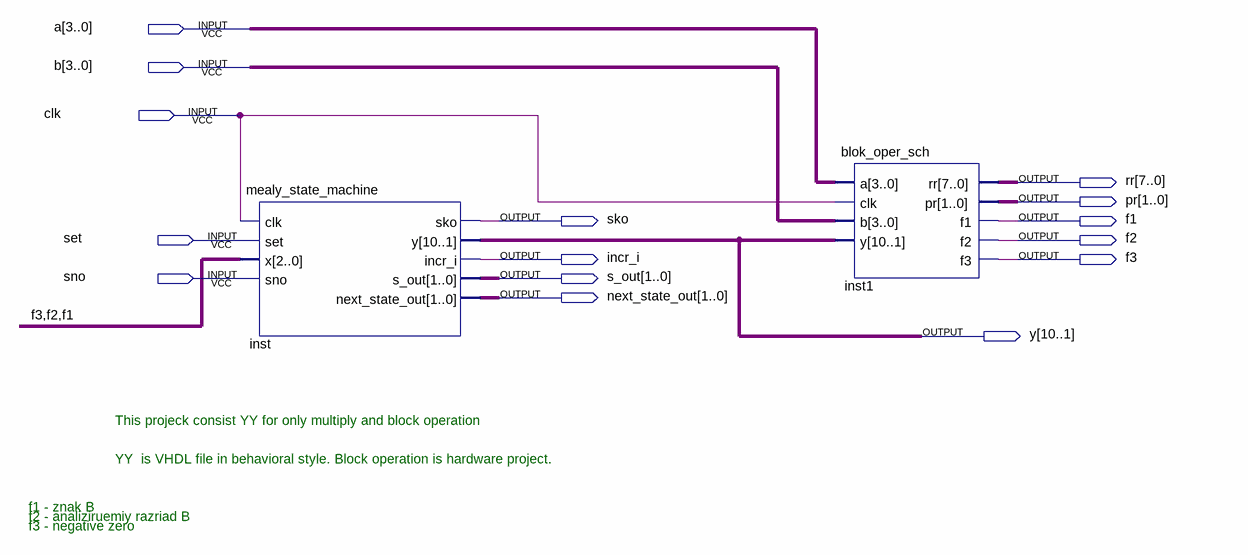
[diagram p0: schematic sheet]
// Quartus schematic alu_vhdl.bdf as structural Verilog: 2 symbols, 15 pins
module alu_vhdl (
  input  [3:0] a,
  input  [3:0] b,
  input  clk,
  input  set,
  input  sno,
  output [7:0] rr,
  output [1:0] pr,
  output sko,
  output f1,
  output f2,
  output incr_i,
  output f3,
  output [1:0] s_out,
  output [1:0] next_state_out,
  output [10:1] y
);

  mealy_state_machine inst (
    .clk(clk), .set(set), .x({f3, f2, f1}), .sno(sno), .sko(sko), .y(y), .incr_i(incr_i), .s_out(s_out),
    .next_state_out(next_state_out));
  blok_oper_sch inst1 (.a(a), .clk(clk), .b(b), .y(y), .rr(rr), .pr(pr), .f1(f1), .f2(f2), .f3(f3));

  // Notes on the sheet:
  //   This projeck consist YY for only multiply and block operation
  //   YY  is VHDL file in behavioral style. Block operation is hardware project.
  //   f1 - znak B
  //   f2 - analiziruemiy razriad B
  //   f3 - negative zero
endmodule
